# EAGLE schematic vakuum2 (EAGLE 6.2)
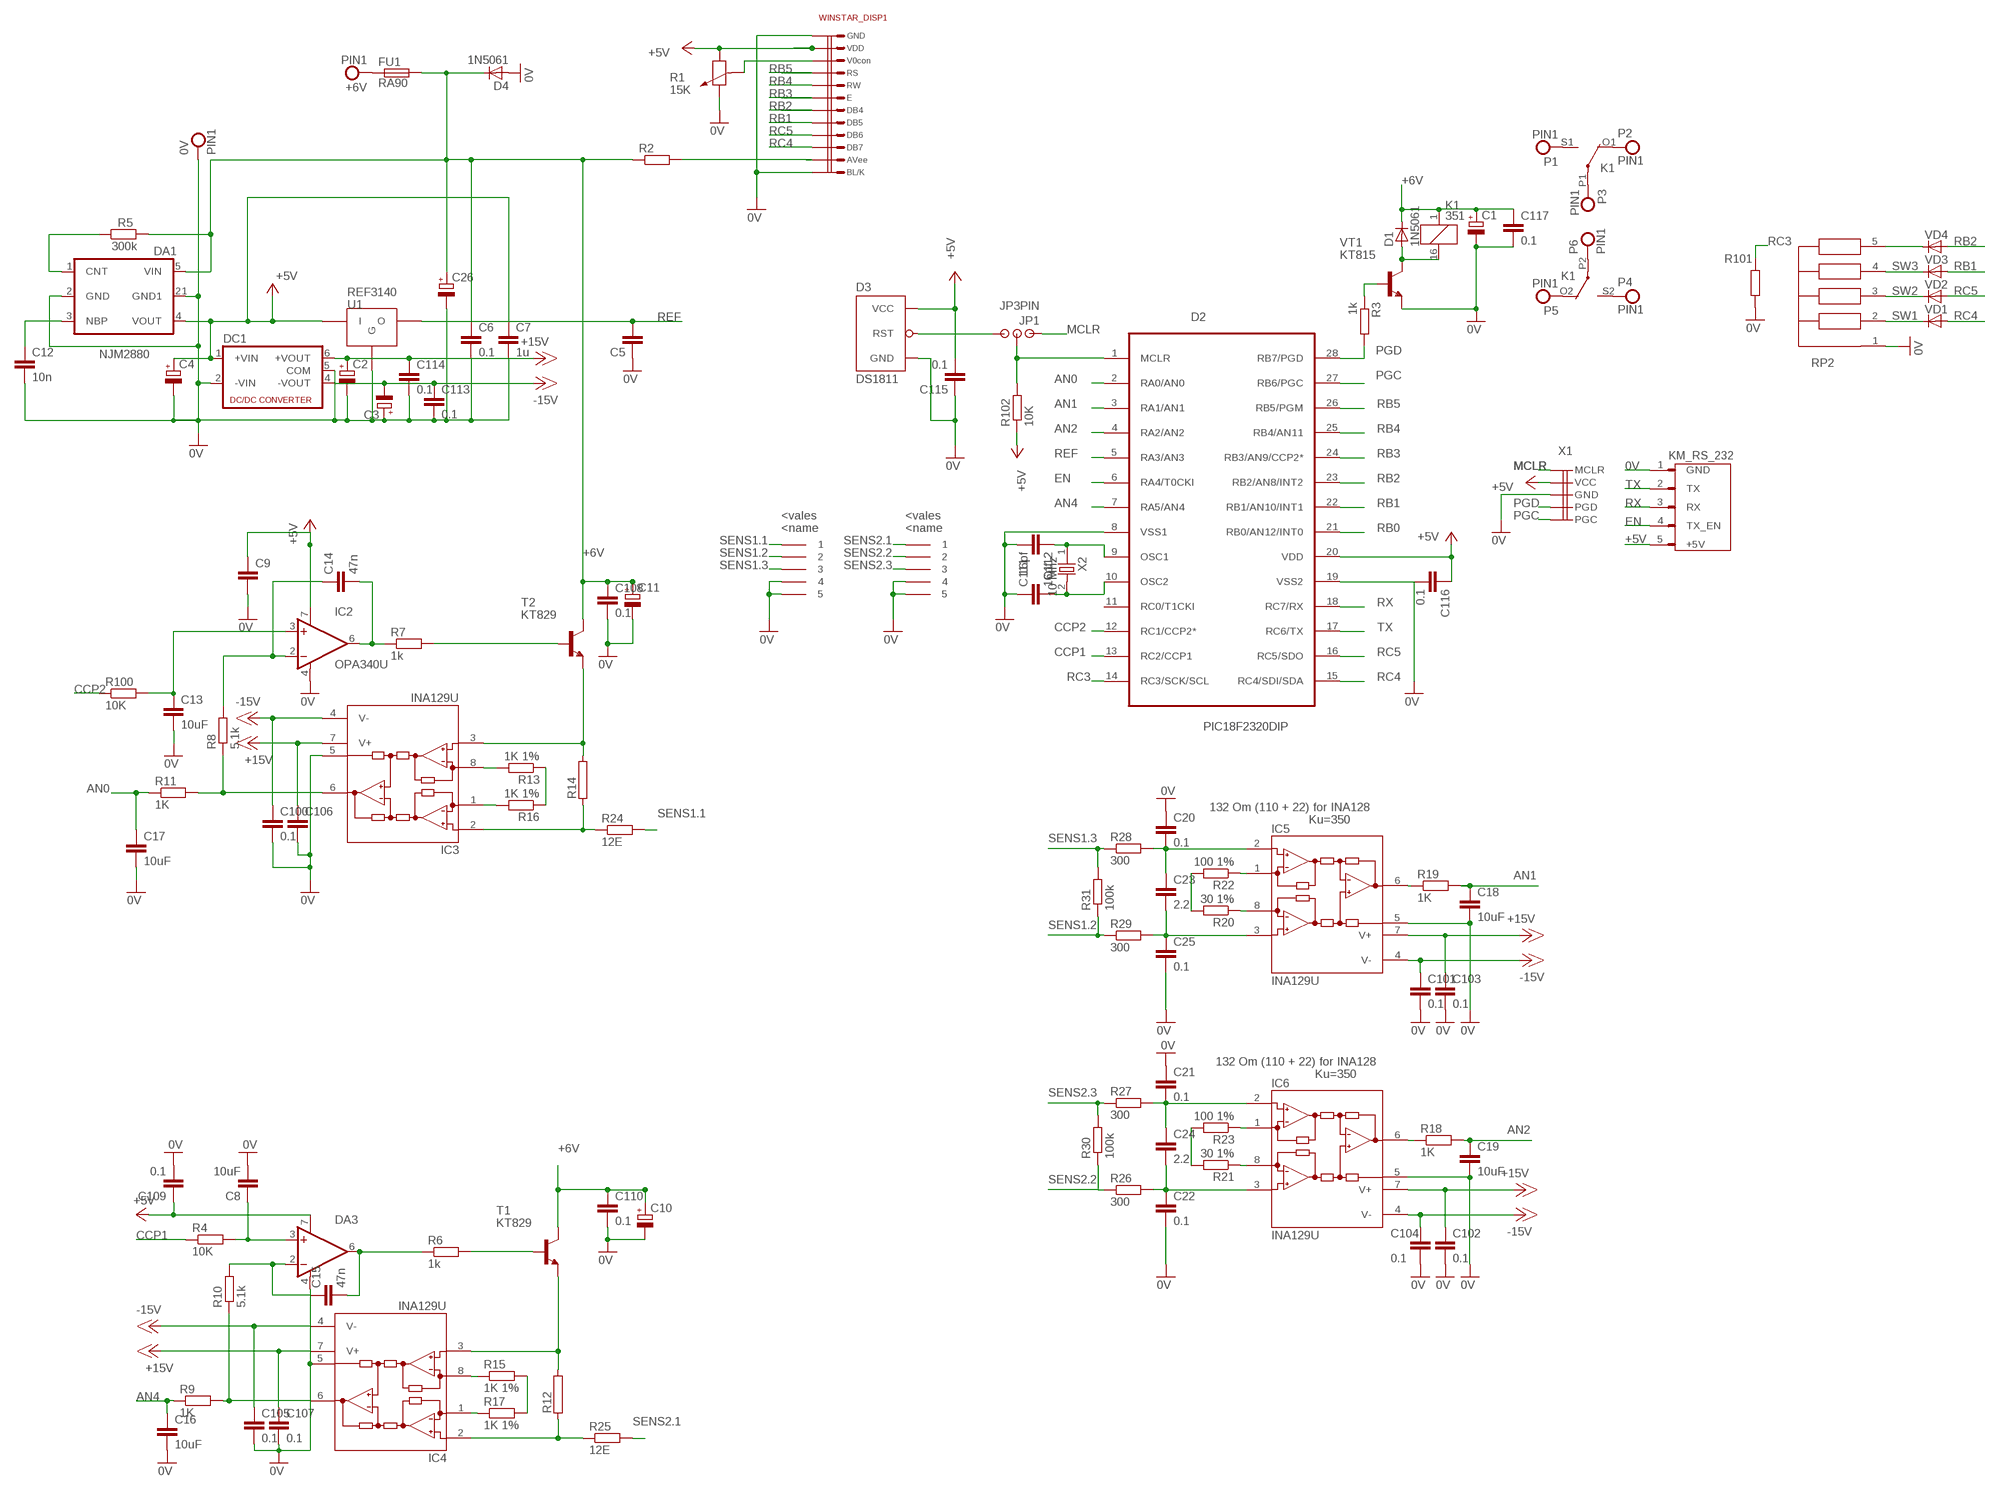
[diagram p0: schematic, sheet 1]

## Parts
0V  PIN1  [PIN1]
+6V  PIN1  [PIN1]
C1  C100MFX25V  [C100MILX6X12]
C2  C100MFX25V  [C100MILX6X12]
C3  C100MFX25V  [C100MILX6X12]
C4  C100MFX25V  [C100MILX6X12]
C5  C0805  [C0805D]
C6  0.1  C0805  [C0805D]
C7  1u  C0805  [C0805D]
C8  10uF  C0805  [C0805D]
C9  C0805  [C0805D]
C10  C100MFX25V  [C100MILX6X12]
C11  C100MFX25V  [C100MILX6X12]
C12  10n  C0805  [C0805D]
C13  10uF  C0805  [C0805D]
C14  47n  C0805  [C0805D]
C15  47n  C0805  [C0805D]
C16  10uF  C0805  [C0805D]
C17  10uF  C0805  [C0805D]
C18  10uF  C0805  [C0805D]
C19  10uF  C0805  [C0805D]
C20  0.1  C0805  [C0805D]
C21  0.1  C0805  [C0805D]
C22  0.1  C0805  [C0805D]
C23  2.2  C0805  [C0805D]
C24  2.2  C0805  [C0805D]
C25  0.1  C0805  [C0805D]
C26  C100MFX25V  [C100MILX6X12]
C100  0.1  C0805  [C0805D]
C101  0.1  C0805  [C0805D]
C102  0.1  C0805  [C0805D]
C103  0.1  C0805  [C0805D]
C104  0.1  C0805  [C0805D]
C105  0.1  C0805  [C0805D]
C106  C0805  [C0805D]
C107  0.1  C0805  [C0805D]
C108  0.1  C0805  [C0805D]
C109  0.1  C0805  [C0805D]
C110  0.1  C0805  [C0805D]
C111  16pf  C0805  [C0805D]
C112  16pf  C0805  [C0805D]
C113  0.1  C0805  [C0805D]
C114  0.1  C0805  [C0805D]
C115  0.1  C0805  [C0805D]
C116  0.1  C0805  [C0805D]
C117  0.1  C0805  [C0805D]
D1  1N5061  [DO41-10]
D2  PIC18F2320DIP  [DIL28-3]
D3  DS1811  [TO92-60]
D4  1N5061  [DO41-10]
DA1  NJM2880  [SOT89-5]
DA3  OPA340U  [SO08]
DC1  NMA  [NMA]
FU1  RA90  [RA90]
IC2  OPA340U  [SO08]
IC3  INA129U  [SO08]
IC4  INA129U  [SO08]
IC5  INA129U  [SO08]
IC6  INA129U  [SO08]
JP1  JP3PIN  [PLC-3PIN]
K1  351  [351]
P1  PIN1  [PIN1]
P2  PIN1  [PIN1]
P3  PIN1  [PIN1]
P4  PIN1  [PIN1]
P5  PIN1  [PIN1]
P6  PIN1  [PIN1]
R1  15K  RTRIM3329H  [RTRIM3329H]
R2  MLT025"  [0207/10]
R3  1k  MLT025"  [0207/10]
R4  10K  R0805  [R0805D]
R5  300k  R0805  [R0805D]
R6  1k  MLT025"  [0207/10]
R7  1k  R0805  [R0805D]
R8  5.1k  R0805  [R0805D]
R9  1K  R0805  [R0805D]
R10  5.1k  R0805  [R0805D]
R11  1K  R0805  [R0805D]
R12  RHPS932  [HPS932]
R13  1K 1%  R0805  [R0805D]
R14  RHPS932  [HPS932]
R15  1K 1%  R0805  [R0805D]
R16  1K 1%  R0805  [R0805D]
R17  1K 1%  R0805  [R0805D]
R18  1K  R0805  [R0805D]
R19  1K  R0805  [R0805D]
R20  30 1%  R0805  [R0805D]
R21  30 1%  R0805  [R0805D]
R22  100 1%  R0805  [R0805D]
R23  100 1%  R0805  [R0805D]
R24  12E  MLT025"  [0207/10]
R25  12E  MLT025"  [0207/10]
R26  300  R0805  [R0805D]
R27  300  R0805  [R0805D]
R28  300  R0805  [R0805D]
R29  300  R0805  [R0805D]
R30  100k  R0805  [R0805D]
R31  100k  R0805  [R0805D]
R100  10K  R0805  [R0805D]
R101  10k  R0805  [R0805D]
R102  10K  R0805  [R0805D]
RP2  NR1-4-4  [SIP5]
T1  KT829  2SC1969H  [T-30]
T2  KT829  2SC1969H  [T-30]
U1  REF3140  [SOT23-W]
VD1  KD521  [DO35-10]
VD2  KD521  [DO35-10]
VD3  KD521  [DO35-10]
VD4  KD521  [DO35-10]
VT1  KT815  [TO126V]
WINSTAR_DISP1  WINSTAR16X4DSPL_12  [WINSTAR16X4_12]
X1  PIC_ISP_CONN  [PLC-5PIN]
X2  10 Mhz  HC49/S  [HC49/S]
X3  KM_RS_232  [KM_RS_232]
X4  MB332-381  [MB332-381]
X5  MB332-381  [MB332-381]

## Nets
0V: 0V.P$1 C1.MINUS(-) C2.MINUS(-) C3.PLUS(+) C4.MINUS(-) C5.1 C6.2 C7.2 C8.2 C9.2 C10.MINUS(-) C11.MINUS(-) C12.2 C13.2 C16.2 C17.2 C18.2 C19.2 C20.1 C21.1 C22.2 C25.2 C26.MINUS(-) C100.2 C101.2 C102.2 C103.2 C104.2 C105.2 C106.2 C107.2 C108.2 C109.2 C110.2 C111.1 C112.2 C113.2 C114.2 C115.1 C116.2 C117.2 D2.8(VSS1) D2.19(VSS2) D3.3(GND) D4.A DA1.2(GND) DA1.21(GND1) DA3.4(V-) DC1.2(-VIN) DC1.5(COM) IC2.4(V-) IC3.5(REF) IC4.5(REF) IC5.5(REF) IC6.5(REF) R1.2 R101.P$2 RP2.1 U1.GND(G) VT1.1(E) WINSTAR_DISP1.P$1(GND) WINSTAR_DISP1.P$12(KB/L) X1.P$3(GND) X3.1(GND) X4.4 X4.5 X5.4 X5.5
+5V: C4.PLUS(+) C7.1 C9.1 C109.1 C115.2 C116.1 D2.20(VDD) D3.2(VCC) DA1.4(VOUT) DA3.7(V+) DC1.1(+VIN) IC2.7(V+) R1.1 R102.P$1 U1.IN(I) WINSTAR_DISP1.P$2(VDD) X1.P$2(VCC) X3.5(+5V)
+6V: C1.PLUS(+) C6.1 C10.PLUS(+) C11.PLUS(+) C26.PLUS(+) C108.1 C110.1 C117.1 D1.C D4.C DA1.5(VIN) FU1.P$2 K1.1 R2.1 R5.P$2 T1.2(C) T2.2(C)
+15V: C2.PLUS(+) C102.1 C103.1 C106.1 C107.1 C114.1 DC1.6(+VOUT) IC3.7(V+) IC4.7(V+) IC5.7(V+) IC6.7(V+)
-15V: C3.MINUS(-) C100.1 C101.1 C104.1 C105.1 C113.1 DC1.4(-VOUT) IC3.4(V-) IC4.4(V-) IC5.4(V-) IC6.4(V-)
AN0: C17.1 D2.2(RA0/AN0) R11.P$1
AN1: C18.1 D2.3(RA1/AN1) R19.P$2
AN2: C19.1 D2.4(RA2/AN2) R18.P$2
AN4: C16.1 D2.7(RA5/AN4) R9.P$1
CCP1: D2.13(RC2/CCP1) R4.P$1
CCP2: D2.12(RC1/CCP2*) R100.P$1
EN: D2.6(RA4/T0CKI) X3.4(TX_EN)
MCLR: JP1.P$1 X1.P$1(MCLR)
N$1: IC5.6(OUT) R19.P$1
N$2: C112.1 D2.9(OSC1) X2.1
N$3: C23.2 C25.1 IC5.3(+IN) R29.P$2
N$4: C111.2 D2.10(OSC2) X2.2
N$5: R20.P$2 R22.P$2
N$6: IC5.1(RG) R22.P$1
N$7: D2.1(MCLR) JP1.P$2 R102.P$2
N$8: C21.2 C24.1 IC6.2(-IN) R27.P$2
N$9: IC6.8(RG) R21.P$1
N$10: IC6.1(RG) R23.P$1
N$11: C22.1 C24.2 IC6.3(+IN) R26.P$2
N$12: IC4.8(RG) R15.P$1
N$13: IC6.6(OUT) R18.P$1
N$14: R15.P$2 R17.P$2
N$15: R13.P$1 R16.P$1
N$16: IC5.8(RG) R20.P$1
N$17: R21.P$2 R23.P$2
N$18: C20.2 C23.1 IC5.2(-IN) R28.P$2
N$19: R2.2 WINSTAR_DISP1.P$11(AVEE)
N$20: C15.1 DA3.2(-IN) R10.P$2
N$21: +6V.P$1 FU1.P$1
N$22: IC3.6(OUT) R8.P$1 R11.P$2
N$23: D3.1(RST) JP1.P$3
N$24: R1.3 WINSTAR_DISP1.P$3(V0CON)
N$29: C14.2 IC2.6(OUT) R7.P$1
N$30: C13.1 IC2.3(+IN) R100.P$2
N$31: R7.P$2 T2.1(B)
N$32: IC3.8(RG) R13.P$2
N$33: IC3.1(RG) R16.P$2
N$34: IC3.3(+IN) R14.2 T2.3(E)
N$35: IC3.2(-IN) R14.1 R24.1
N$37: D1.A K1.16 VT1.2(C)
N$38: IC4.6(OUT) R9.P$2 R10.P$1
N$39: C14.1 IC2.2(-IN) R8.P$2
N$40: K1.S2(3:S) P4.P$1
N$41: C15.2 DA3.6(OUT) R6.1
N$42: C8.1 DA3.3(+IN) R4.P$2
N$43: R6.2 T1.1(B)
N$44: R3.1 VT1.3(B)
N$45: IC4.1(RG) R17.P$1
N$46: IC4.3(+IN) R12.2 T1.3(E)
N$47: IC4.2(-IN) R12.1 R25.1
N$48: DA1.1(CNT) R5.P$1
N$49: C12.1 DA1.3(NBP)
N$50: K1.O2(3:O) P5.P$1
N$51: K1.S1(2:S) P1.P$1
N$52: K1.O1(2:O) P2.P$1
N$53: K1.P1(2:P) P3.P$1
N$54: K1.P2(3:P) P6.P$1
PGC: D2.27(RB6/PGC) X1.P$5(PGC)
PGD: D2.28(RB7/PGD) R3.2 X1.P$4(PGD)
RB0: D2.21(RB0/AN12/INT0)
RB1: D2.22(RB1/AN10/INT1) VD3.A WINSTAR_DISP1.P$8(DB5)
RB2: D2.23(RB2/AN8/INT2) VD4.A WINSTAR_DISP1.P$7(DB4)
RB3: D2.24(RB3/AN9/CCP2*) WINSTAR_DISP1.P$6(E)
RB4: D2.25(RB4/AN11) WINSTAR_DISP1.P$5(RW)
RB5: D2.26(RB5/PGM) WINSTAR_DISP1.P$4(RS)
RC3: D2.14(RC3/SCK/SCL) R101.P$1
RC4: D2.15(RC4/SDI/SDA) VD1.A WINSTAR_DISP1.P$10(DB7)
RC5: D2.16(RC5/SDO) VD2.A WINSTAR_DISP1.P$9(DB6)
REF: C5.2 D2.5(RA3/AN3) U1.OUT(O)
RX: D2.18(RC7/RX) X3.3(RX)
SENS1.1: R24.2 X4.1
SENS1.2: R29.P$1 R31.P$1 X4.2
SENS1.3: R28.P$1 R31.P$2 X4.3
SENS2.1: R25.2 X5.1
SENS2.2: R26.P$1 R30.P$1 X5.2
SENS2.3: R27.P$1 R30.P$2 X5.3
SW1: RP2.2 VD1.C
SW2: RP2.3 VD2.C
SW3: RP2.4 VD3.C
SW4: RP2.5 VD4.C
TX: D2.17(RC6/TX) X3.2(TX)
Unconnected: D2.11(RC0/T1CKI)

## Notes on the sheet
- 132 Om (110 + 22) for INA128
- Ku=350
- 132 Om (110 + 22) for INA128
- Ku=350

## Library data of the parts
0V +6V P1-P6 = den:PIN1
C1-C4 C10 C11 C26 = den:C100MFX25V
C5-C9 C12-C25 C100-C117 = den:C0805
D1 D4 = den:1N5061
D2 = den:PIC18F2320
D3 = den:DS1811
DA1 = den:NJM2880
DA3 IC2 = burr-brown:OPA340: Rail-to-Rail Operational Amplifiers Single-Supply, MicroAmplifier(TM) Series; MPN: OPA340UA; OC_FARNELL: 1106196; OC_NEWARK: 24M5449
DC1 = dc-dc-converter:NMA: DC-DC CONVERTER; MF: C & D TECHNOLOGIES, INC; MPN: NMA0515SC; OC_FARNELL: 1021434; OC_NEWARK: 61K3064
FU1 = den:RA90
IC3-IC6 = burr-brown:INA129: Instrumentation Amplifiers Precision, Low Power; MF: TEXAS INSTRUMENTS; MPN: INA129U; OC_FARNELL: 1212415; OC_NEWARK: 35C1732
JP1 = den:JP3PIN
K1 = relay:351: RELAY 2 x switch, Omron; OC_FARNELL: unknown; OC_NEWARK: unknown
R1 = Dmitry:RTRIM3329H
R2 R3 R6 R24 R25 = den:MLT025
R4 R5 R7-R11 R13 R15-R23 R26-R31 R100-R102 = den:R0805
R12 R14 = resistor-power:R: Power Resitor; OC_FARNELL: unknown; OC_NEWARK: unknown
RP2 = den:NR1-4-4
T1 T2 = transistor:2SC1969: NPN Epitaxial Planar Transistor RF Power Amplifier Source: 2sc1969.pdf
U1 = ref:REF3140
VD1-VD4 = den:KD521
VT1 = den:KT815
WINSTAR_DISP1 = Dmitry:WINSTAR16X4DSPL_12
X1 = den:PIC_ISP_CONN
X2 = den:HC49/S
X3 = Dmitry (2):KM_RS_232
X4 X5 = Klem-vint:MB332-381